# Altium schematic sheet tcrt_0.SchDoc
size A4
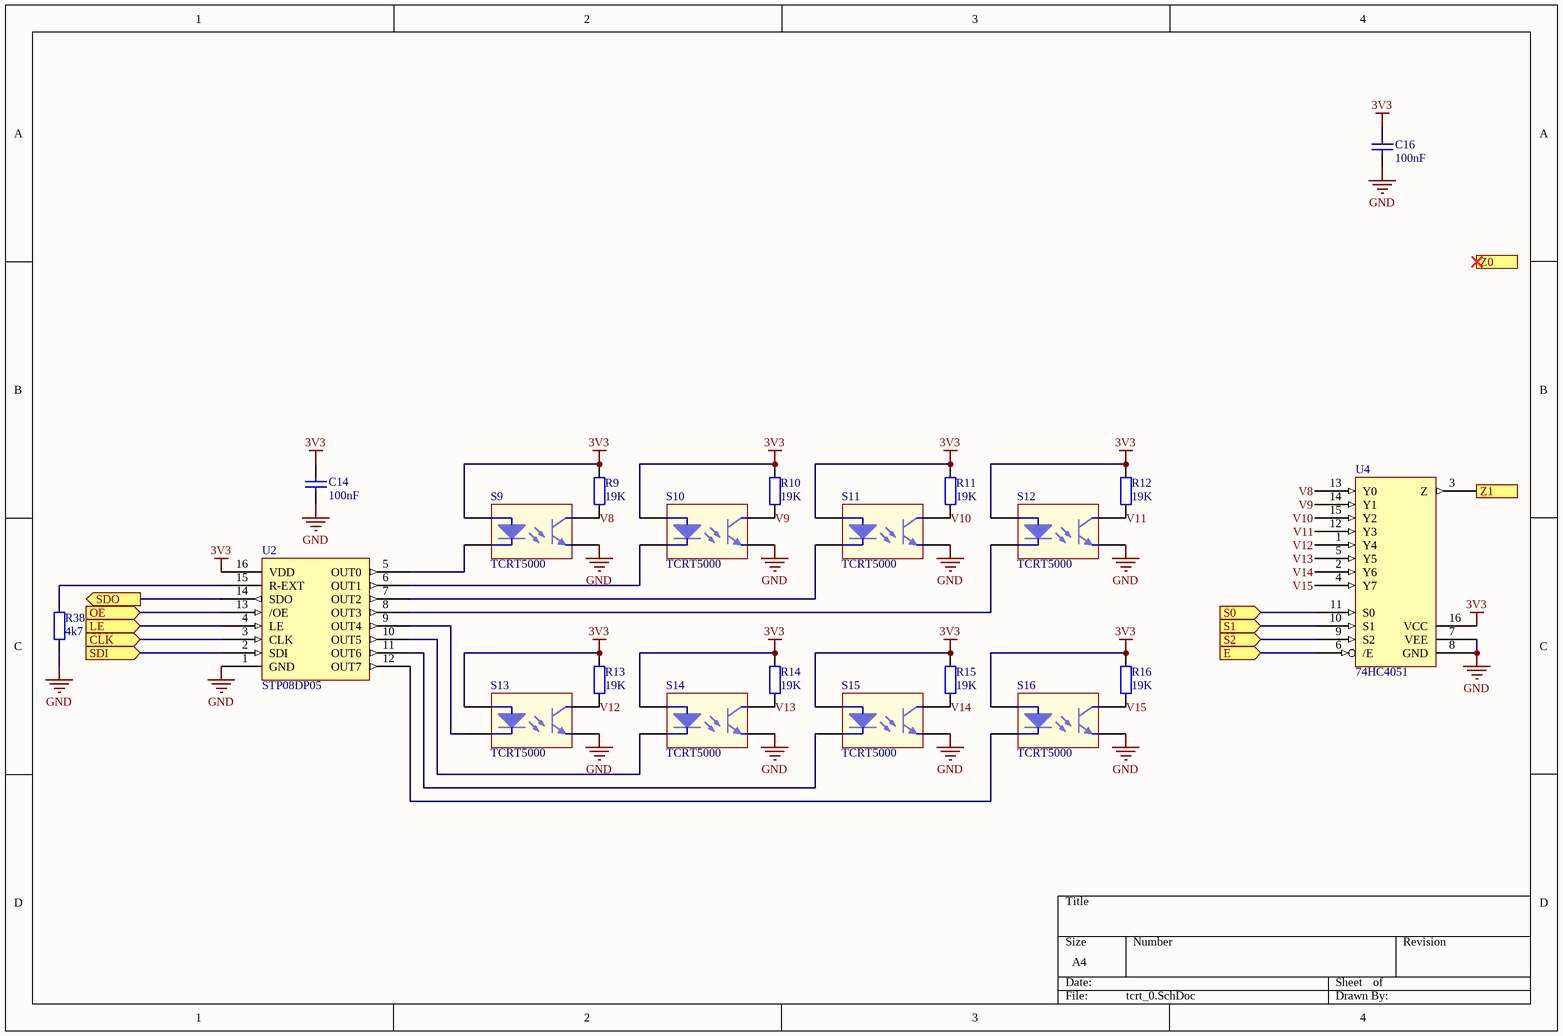
[diagram p0: tcrt_0.SchDoc]

## Parts
C14  100nF  [FP_0805_CAP_085]
C16  100nF  [FP_0805_CAP_085]
R9  19K  [FP_0805_RES]
R10  19K  [FP_0805_RES]
R11  19K  [FP_0805_RES]
R12  19K  [FP_0805_RES]
R13  19K  [FP_0805_RES]
R14  19K  [FP_0805_RES]
R15  19K  [FP_0805_RES]
R16  19K  [FP_0805_RES]
R38  4k7  [FP_0805_RES]
S9  TCRT5000  [TCRT5000_nohole]
S10  TCRT5000  [TCRT5000_nohole]
S11  TCRT5000  [TCRT5000_nohole]
S12  TCRT5000  [TCRT5000_nohole]
S13  TCRT5000  [TCRT5000_nohole]
S14  TCRT5000  [TCRT5000_nohole]
S15  TCRT5000  [TCRT5000_nohole]
S16  TCRT5000  [TCRT5000_nohole]
U2  STP08DP05  [TSSOP16_2]
U4  74HC4051  [TSSOP16_2]

## Ports
CLK (in), E (in), LE (in), OE (in), S0 (in), S1 (in), S2 (in), SDI (in), SDO (out), Z0 (out), Z1 (out)

## Nets
3V3: C14.2 C16.2 R9.2 R10.2 R11.2 R12.2 R13.2 R14.2 R15.2 R16.2 S9.A S10.A S11.A S12.A S13.A S14.A S15.A S16.A U2.16(VDD) U4.16(VCC)
GND: C14.1 C16.1 R38.2 S9.E S10.E S11.E S12.E S13.E S14.E S15.E S16.E U2.1(GND) U4.7(VEE) U4.8(GND)
CLK: U2.3(CLK) ; port CLK
E: U4.6(/E) ; port E
LE: U2.4(LE) ; port LE
OE: U2.13(/OE) ; port OE
S0: U4.11(S0) ; port S0
S1: U4.10(S1) ; port S1
S2: U4.9(S2) ; port S2
SDI: U2.2(SDI) ; port SDI
SDO: U2.14(SDO) ; port SDO
V8: R9.1 S9.Coll(C) U4.13(Y0)
V9: R10.1 S10.Coll(C) U4.14(Y1)
V10: R11.1 S11.Coll(C) U4.15(Y2)
V11: R12.1 S12.Coll(C) U4.12(Y3)
V12: R13.1 S13.Coll(C) U4.1(Y4)
V13: R14.1 S14.Coll(C) U4.5(Y5)
V14: R15.1 S15.Coll(C) U4.2(Y6)
V15: R16.1 S16.Coll(C) U4.4(Y7)
Z1: U4.3(Z) ; port Z1
NetR38_1: R38.1 U2.15(R-EXT)
NetS9_Cath: S9.Cath(K) U2.5(OUT0)
NetS10_Cath: S10.Cath(K) U2.6(OUT1)
NetS11_Cath: S11.Cath(K) U2.7(OUT2)
NetS12_Cath: S12.Cath(K) U2.8(OUT3)
NetS13_Cath: S13.Cath(K) U2.9(OUT4)
NetS14_Cath: S14.Cath(K) U2.10(OUT5)
NetS15_Cath: S15.Cath(K) U2.11(OUT6)
NetS16_Cath: S16.Cath(K) U2.12(OUT7)

## Library data of the parts
C14 C16 = CAP: Capacitor; Value: 100nF
R9-R16 R38 = RES: Resistor
  R9-R16: Value: 19K
  R38: Value: 4k7
S9-S16 = TCRT5000: Reflective Optical Sensor; Reference: 1003.5545; Name: IR érzékelő; Supplier: Hestore
U2 = STP08DP05: LED driver [8]
U4 = 74HC4051: Analog multiplexer; Reference: 2445304; Supplier: Farnell